# Altium project PCB_Project.PrjPcb
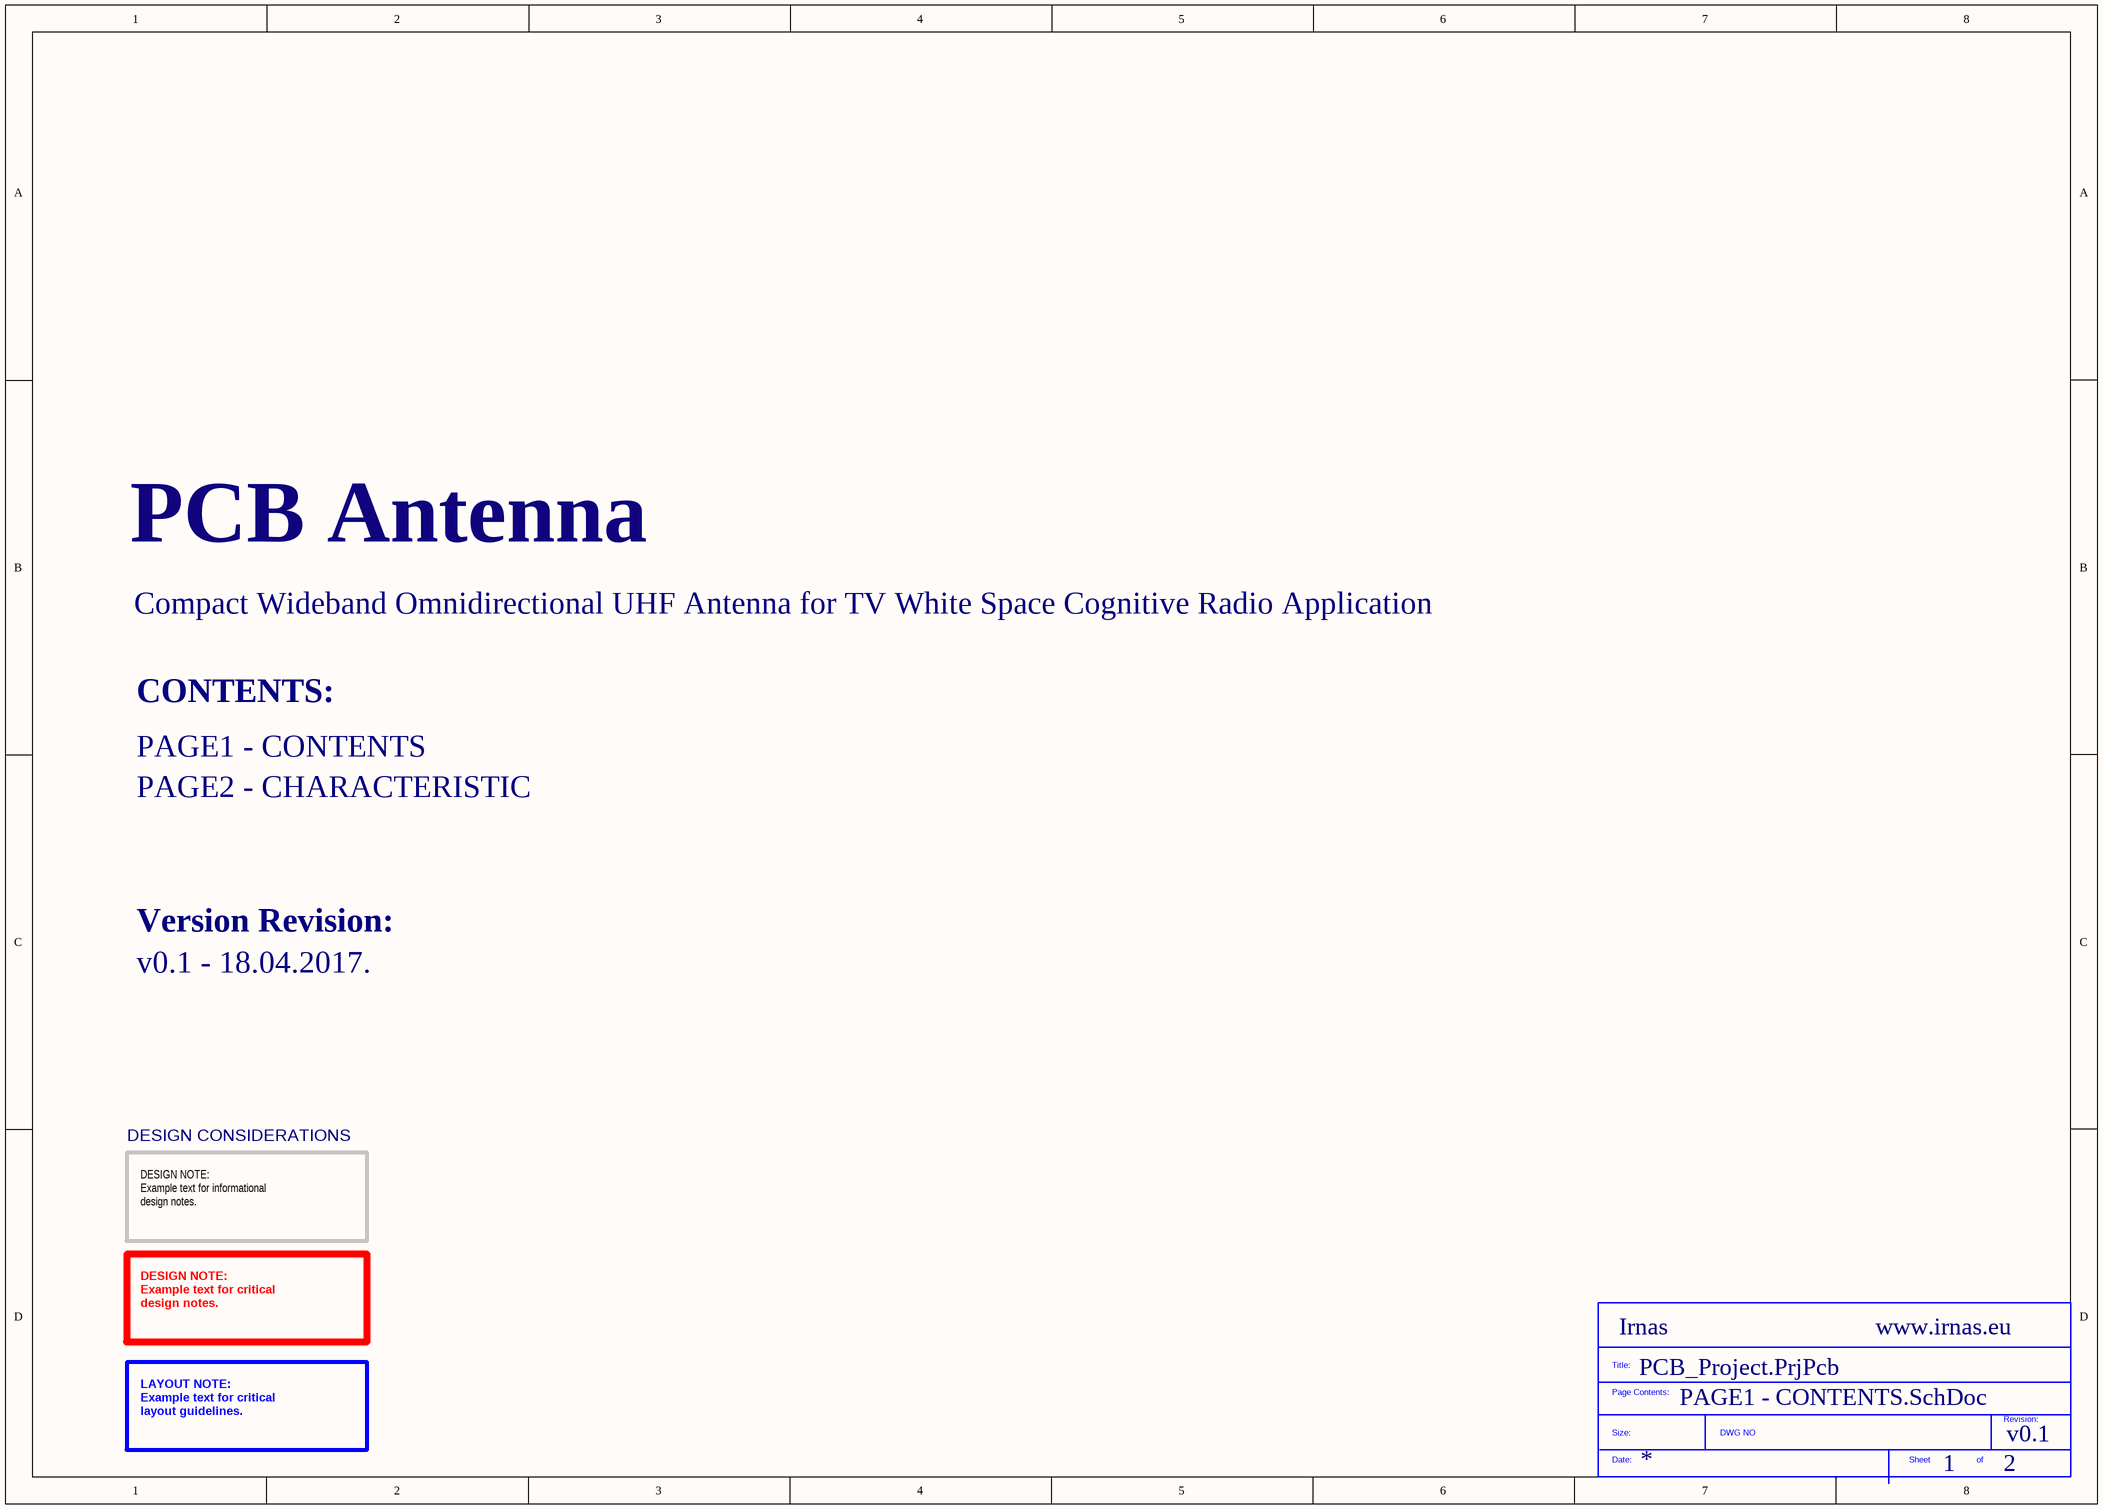
[diagram p0: PAGE1 - CONTENTS.SchDoc]
Website: www.irnas.eu; Version: v0.1; ProjectTitile: PCB Antenna; Company: Irnas
2 sheets, 3 parts. Net scope: global (net labels, ports and power ports of the same name join across sheets).
Board file: pcb_antenna_PCB.PcbDoc
Sheets:
  PAGE1 - CONTENTS.SchDoc
  PAGE2 - CHARACTERISTIC.SchDoc

## Sheet PAGE1 - CONTENTS.SchDoc
size A3; DocumentNumber: 1; SheetNumber: 1; SheetTotal: 2

### Parts
(Parts that share a designator on the sheet are numbered #1, #2 ... from top to bottom, then left to right.)
*?#1  SDTitleBlock  (value not drawn)  (graphical)

### Notes on the sheet
- Compact Wideband Omnidirectional UHF Antenna for TV White Space Cognitive Radio Application
- CONTENTS:
- PAGE1 - CONTENTS
- PAGE2 - CHARACTERISTIC
- Version Revision:
- v0.1 - 18.04.2017.
- DESIGN CONSIDERATIONS
- DESIGN NOTE:
  Example text for informational
  design notes.
- DESIGN NOTE:
  Example text for critical
  design notes.
- LAYOUT NOTE:
  Example text for critical
  layout guidelines.
- (in symbol SDTitleBlock) Title:; Page Contents:; Revision:; Size:; DWG NO; Date:; Sheet; of

## Sheet PAGE2 - CHARACTERISTIC.SchDoc
size A3; DocumentNumber: 2; SheetNumber: 2; SheetTotal: 2
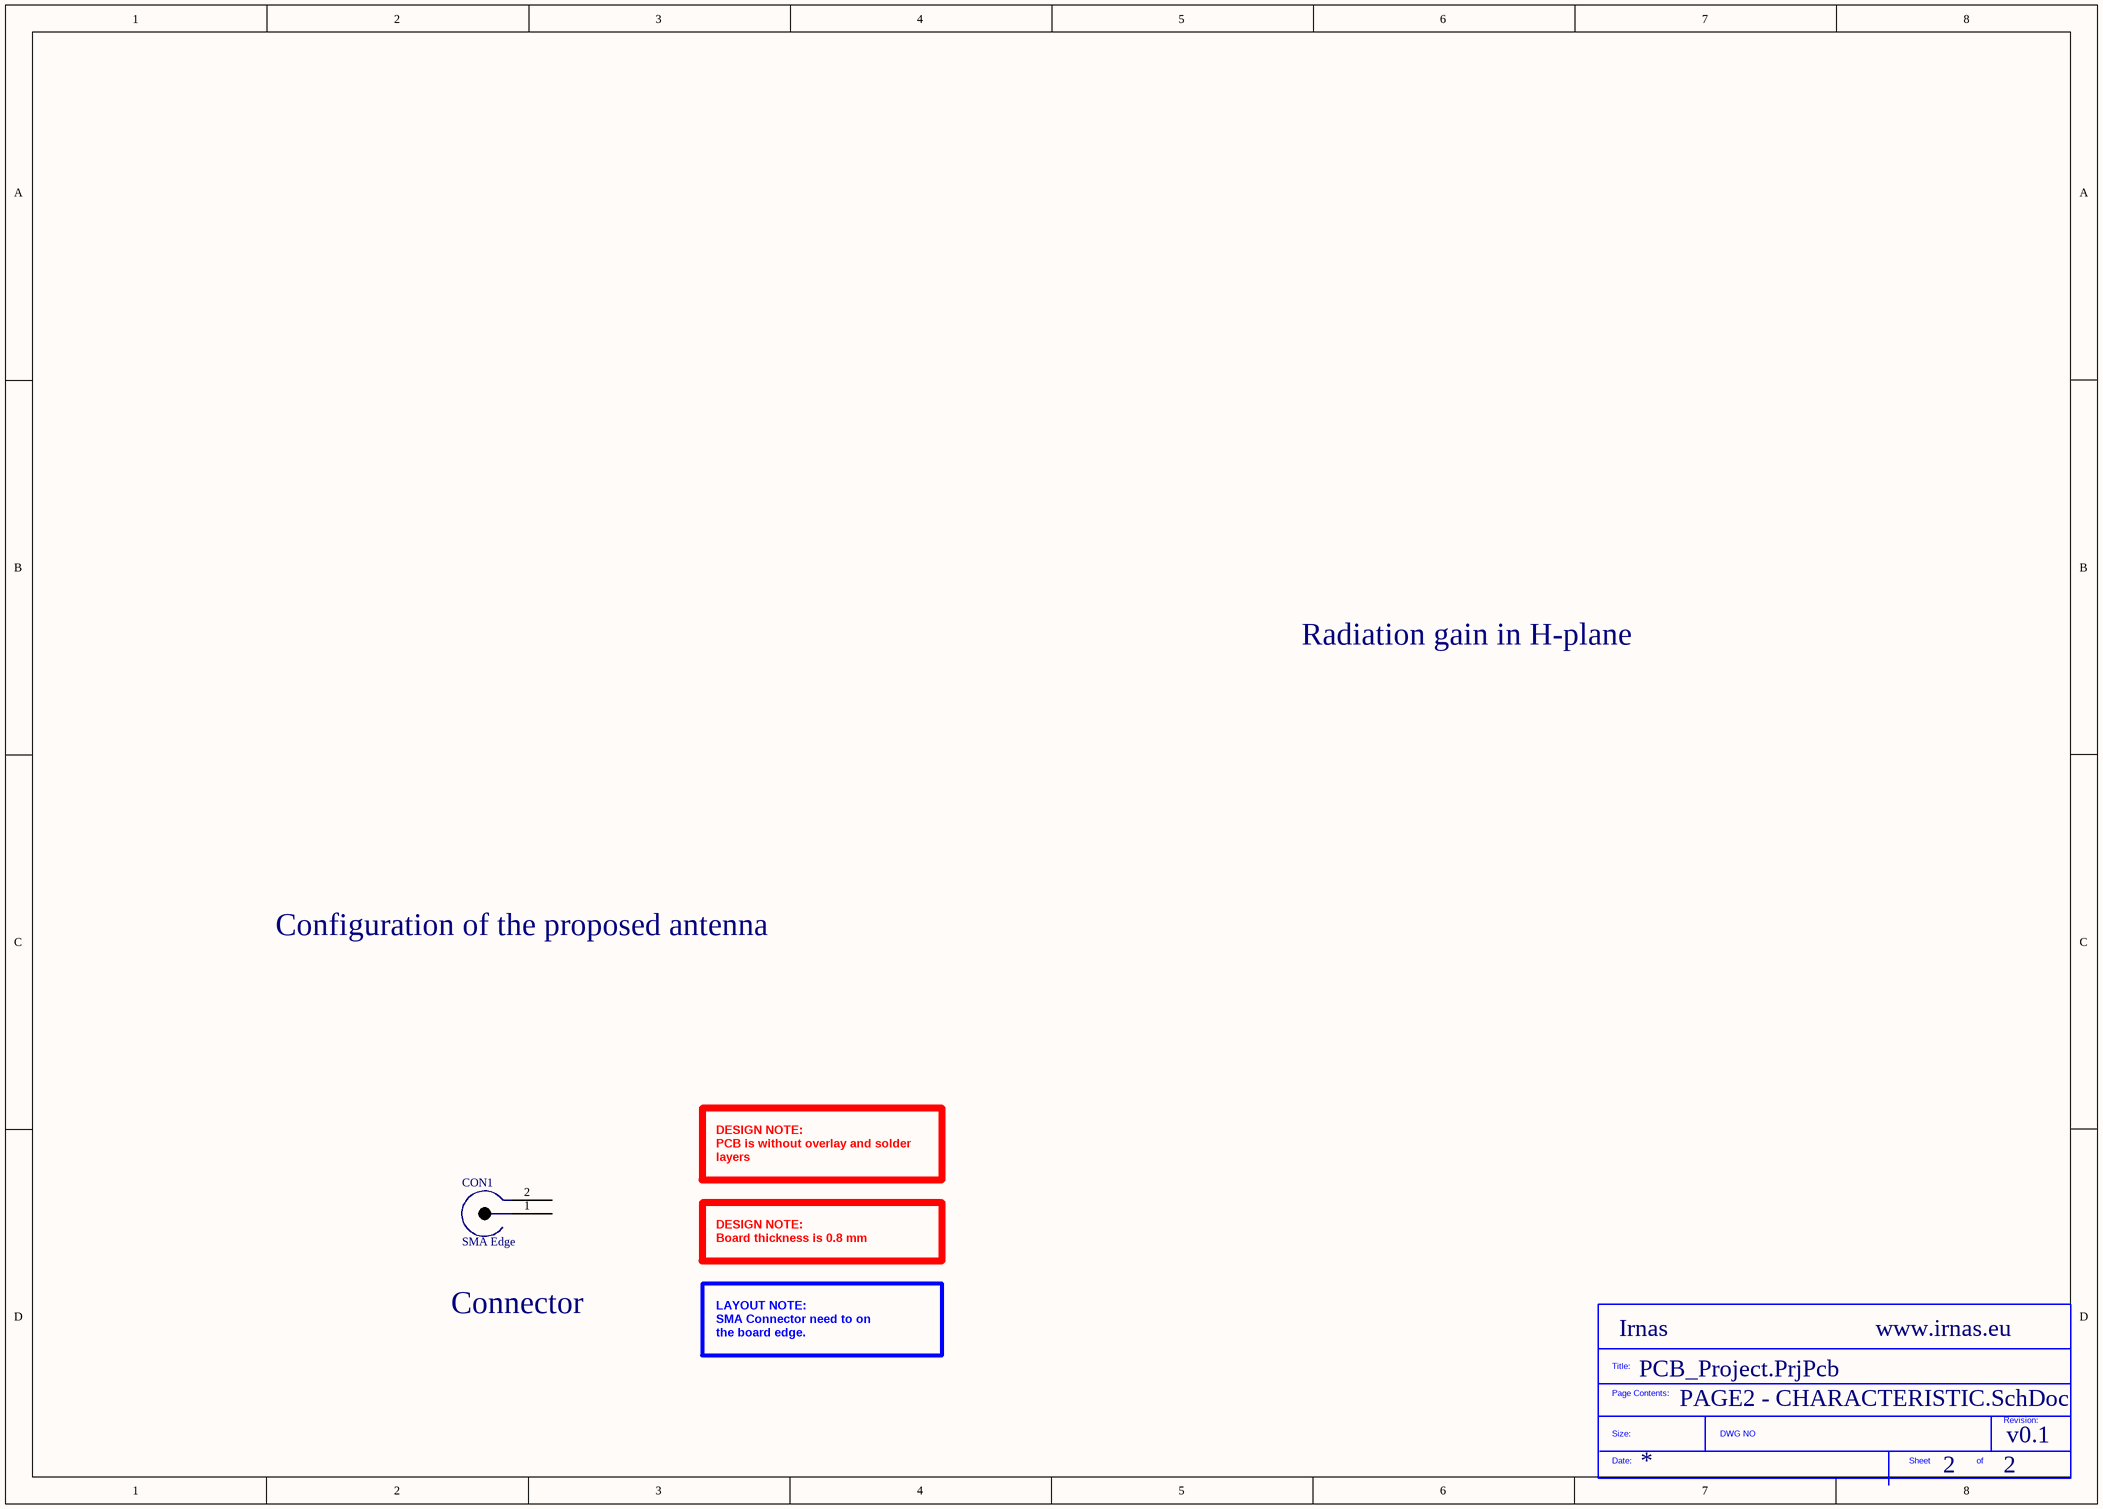
[diagram p1: PAGE2 - CHARACTERISTIC.SchDoc]

### Parts
(Parts that share a designator on the sheet are numbered #1, #2 ... from top to bottom, then left to right.)
*?#2  SDTitleBlock  (value not drawn)  (graphical)
CON1  SMA Edge  [SMA_EDGE_1]

### Nets

Not connected (* = marked no-connect by the designer): CON1 1 2

### Notes on the sheet
- Radiation gain in H-plane
- Configuration of the proposed antenna
- DESIGN NOTE:
  PCB is without overlay and solder layers
- Connector
- DESIGN NOTE:
  Board thickness is 0.8 mm
- LAYOUT NOTE:
  SMA Connector need to on
  the board edge.
- (in symbol SDTitleBlock) Title:; Page Contents:; Revision:; Size:; DWG NO; Date:; Sheet; of

### Library data of the parts
CON1 = 142-0701-881: JOHNSON - 142-0701-881 - RF COAXIAL, SMA, STRAIGHT JACK, 50OHM; Supplier 1: Farnell; Manufacturer: JOHNSON; Manufacturer Part Number: 142-0701-881; RoHS: YES; Stock 1: 770; Pricing 1: 1=3.08 (GBP); ComponentLink1URL: http://www.farnell.com/datasheets/610139.pdf; ComponentLink1Description: http://www.farnell.com/datasheets/610139.pdf; Supplier Part Number 1: 1608603